# Altium schematic sheet Power Diagram.SchDoc
size A; SheetNumber: 2; SheetTotal: 6
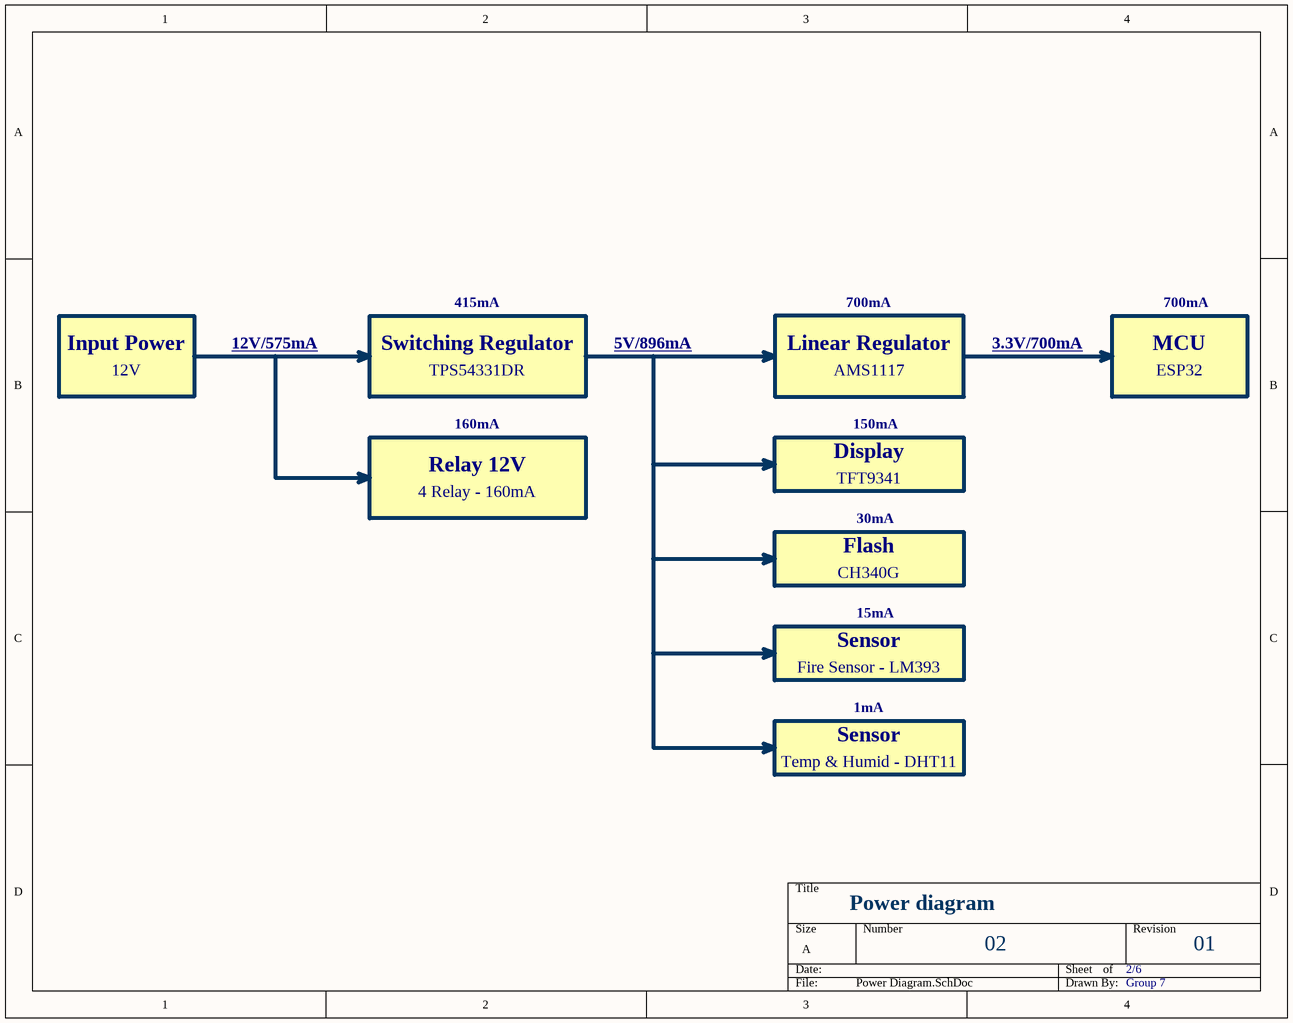
[diagram p0: Power Diagram.SchDoc]

## Notes on the sheet
- 415mA
- 700mA
- Input Power
- 12V
- 12V/575mA
- TPS54331DR
- Switching Regulator
- 5V/896mA
- Linear Regulator
- AMS1117
- 3.3V/700mA
- MCU
- ESP32
- 160mA
- 150mA
- Relay 12V
- 4 Relay - 160mA
- Display
- TFT9341
- Flash
- CH340G
- 30mA
- Sensor
- 15mA
- Fire Sensor - LM393
- 1mA
- Temp & Humid - DHT11
- Power diagram
- 02
- 2/6
- 01
- Group 7